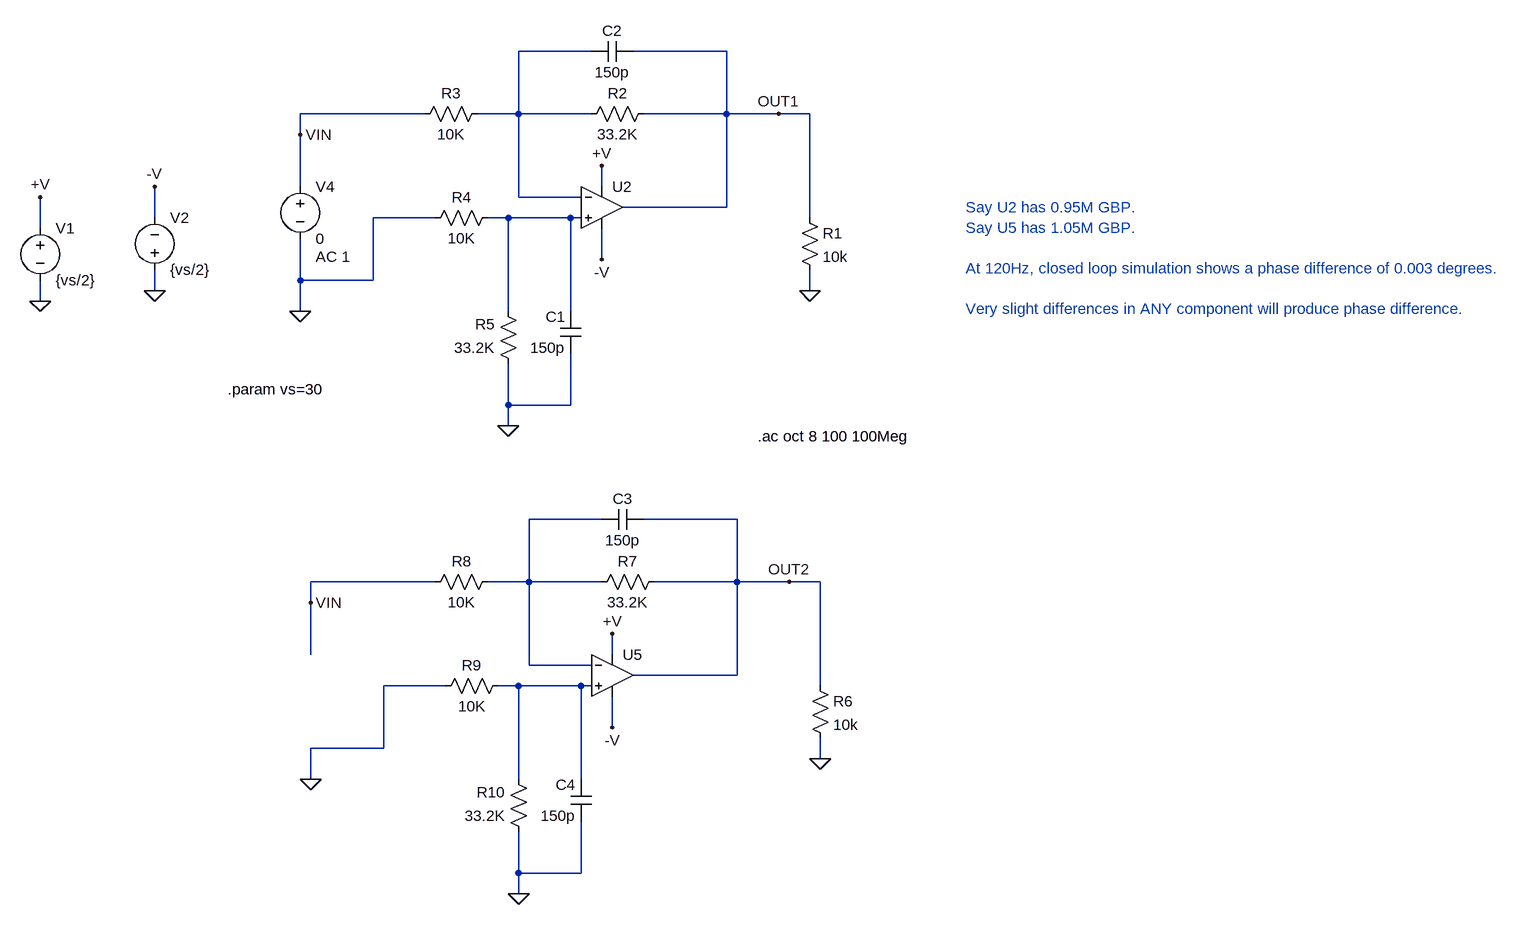
[diagram p0: schematic UnivOpAmp_AC_ClosedLoopLOC.asc]
UnivOpAmp_AC_ClosedLoopLOC.asc, the LTspice schematic file:
Version 4
SHEET 1 1700 1284
WIRE 256 -32 144 -32
WIRE 464 -32 320 -32
WIRE 0 64 -192 64
WIRE 144 64 144 -32
WIRE 144 64 80 64
WIRE 256 64 144 64
WIRE 464 64 464 -32
WIRE 464 64 336 64
WIRE 544 64 464 64
WIRE 592 64 544 64
WIRE -192 96 -192 64
WIRE -192 176 -192 96
WIRE 272 176 272 144
WIRE 144 192 144 64
WIRE 240 192 144 192
WIRE 464 208 464 64
WIRE 464 208 304 208
WIRE -416 224 -416 176
WIRE 16 224 -80 224
WIRE 128 224 96 224
WIRE 224 224 128 224
WIRE 240 224 224 224
WIRE 592 224 592 64
WIRE -592 240 -592 192
WIRE 272 288 272 240
WIRE -192 320 -192 256
WIRE -80 320 -80 224
WIRE -80 320 -192 320
WIRE -416 336 -416 304
WIRE 592 336 592 304
WIRE -592 352 -592 320
WIRE -192 368 -192 320
WIRE 128 368 128 224
WIRE 224 368 224 224
WIRE 128 512 128 448
WIRE 224 512 224 432
WIRE 224 512 128 512
WIRE 128 544 128 512
WIRE 272 688 160 688
WIRE 480 688 336 688
WIRE 16 784 -176 784
WIRE 160 784 160 688
WIRE 160 784 96 784
WIRE 272 784 160 784
WIRE 480 784 480 688
WIRE 480 784 352 784
WIRE 560 784 480 784
WIRE 608 784 560 784
WIRE -176 816 -176 784
WIRE -176 896 -176 816
WIRE 288 896 288 864
WIRE 160 912 160 784
WIRE 256 912 160 912
WIRE 480 928 480 784
WIRE 480 928 320 928
WIRE 32 944 -64 944
WIRE 144 944 112 944
WIRE 240 944 144 944
WIRE 256 944 240 944
WIRE 608 944 608 784
WIRE 288 1008 288 960
WIRE -64 1040 -64 944
WIRE -64 1040 -176 1040
WIRE 608 1056 608 1024
WIRE -176 1088 -176 1040
WIRE 144 1088 144 944
WIRE 240 1088 240 944
WIRE 144 1232 144 1168
WIRE 240 1232 240 1152
WIRE 240 1232 144 1232
WIRE 144 1264 144 1232
FLAG -592 352 0
FLAG -416 336 0
FLAG -592 192 +V
FLAG -416 176 -V
FLAG 272 144 +V
FLAG 272 288 -V
FLAG 592 336 0
FLAG 544 64 OUT1
FLAG -192 368 0
FLAG -192 96 VIN
FLAG 128 544 0
FLAG 288 864 +V
FLAG 288 1008 -V
FLAG 608 1056 0
FLAG 560 784 OUT2
FLAG -176 1088 0
FLAG -176 816 VIN
FLAG 144 1264 0
SYMBOL voltage -592 224 R0
SYMATTR InstName V1
SYMATTR Value {vs/2}
SYMBOL voltage -416 320 M180
WINDOW 0 24 96 Left 2
WINDOW 3 24 16 Left 2
WINDOW 123 0 0 Left 2
WINDOW 39 24 -12 Left 2
SYMATTR InstName V2
SYMATTR Value {vs/2}
SYMBOL res 576 208 R0
SYMATTR InstName R1
SYMATTR Value 10k
SYMBOL res 352 48 R90
WINDOW 0 0 56 VBottom 2
WINDOW 3 32 56 VTop 2
SYMATTR InstName R2
SYMATTR Value 33.2K
SYMBOL res 96 48 R90
WINDOW 0 0 56 VBottom 2
WINDOW 3 32 56 VTop 2
SYMATTR InstName R3
SYMATTR Value 10K
SYMBOL Opamps\\UniversalOpamp2 272 208 R0
SYMATTR InstName U2
SYMATTR Value2 Avol=4Meg GBW=0.95Meg Slew=0.8Meg
SYMBOL cap 320 -48 R90
WINDOW 0 0 32 VBottom 2
WINDOW 3 32 32 VTop 2
SYMATTR InstName C2
SYMATTR Value 150p
SYMBOL voltage -192 160 R0
WINDOW 123 24 124 Left 2
WINDOW 39 24 124 Left 2
SYMATTR Value2 AC 1
SYMATTR InstName V4
SYMATTR Value 0
SYMBOL res 112 208 R90
WINDOW 0 0 56 VBottom 2
WINDOW 3 32 56 VTop 2
SYMATTR InstName R4
SYMATTR Value 10K
SYMBOL res 144 464 R180
WINDOW 0 36 76 Left 2
WINDOW 3 36 40 Left 2
SYMATTR InstName R5
SYMATTR Value 33.2K
SYMBOL cap 240 432 R180
WINDOW 0 24 56 Left 2
WINDOW 3 24 8 Left 2
SYMATTR InstName C1
SYMATTR Value 150p
SYMBOL res 592 928 R0
SYMATTR InstName R6
SYMATTR Value 10k
SYMBOL res 368 768 R90
WINDOW 0 0 56 VBottom 2
WINDOW 3 32 56 VTop 2
SYMATTR InstName R7
SYMATTR Value 33.2K
SYMBOL res 112 768 R90
WINDOW 0 0 56 VBottom 2
WINDOW 3 32 56 VTop 2
SYMATTR InstName R8
SYMATTR Value 10K
SYMBOL Opamps\\UniversalOpamp2 288 928 R0
SYMATTR InstName U5
SYMATTR Value2 Avol=4Meg GBW=1.05Meg Slew=0.8Meg
SYMBOL cap 336 672 R90
WINDOW 0 0 32 VBottom 2
WINDOW 3 32 32 VTop 2
SYMATTR InstName C3
SYMATTR Value 150p
SYMBOL res 128 928 R90
WINDOW 0 0 56 VBottom 2
WINDOW 3 32 56 VTop 2
SYMATTR InstName R9
SYMATTR Value 10K
SYMBOL res 160 1184 R180
WINDOW 0 36 76 Left 2
WINDOW 3 36 40 Left 2
SYMATTR InstName R10
SYMATTR Value 33.2K
SYMBOL cap 256 1152 R180
WINDOW 0 24 56 Left 2
WINDOW 3 24 8 Left 2
SYMATTR InstName C4
SYMATTR Value 150p
TEXT -304 488 Left 2 !.param vs=30
TEXT 512 560 Left 2 !.ac oct 8 100 100Meg
TEXT 832 208 Left 2 ;Say U2 has 0.95M GBP.\nSay U5 has 1.05M GBP.\n \nAt 120Hz, closed loop simulation shows a phase difference of 0.003 degrees.\n \nVery slight differences in ANY component will produce phase difference.

The netlist it stands for:
* UnivOpAmp_AC_ClosedLoopLOC.asc
V1 +V 0 {vs/2}
V2 0 -V {vs/2}
R1 OUT1 0 10k
R2 OUT1 N001 33.2K
R3 N001 VIN 10K
XU2 N002 N001 +V -V OUT1 level.2 Avol=4Meg GBW=0.95Meg Slew=0.8Meg ilimit=25m rail=0 Vos=0 phimargin=45 en=0 enk=0 in=0 ink=0 Rin=500Meg  ; pins IN+ IN- V+ V- OUT
C2 OUT1 N001 150p
V4 VIN 0 0 AC 1
R4 N002 0 10K
R5 0 N002 33.2K
C1 0 N002 150p
R6 OUT2 0 10k
R7 OUT2 N003 33.2K
R8 N003 VIN 10K
XU5 N004 N003 +V -V OUT2 level.2 Avol=4Meg GBW=1.05Meg Slew=0.8Meg ilimit=25m rail=0 Vos=0 phimargin=45 en=0 enk=0 in=0 ink=0 Rin=500Meg  ; pins IN+ IN- V+ V- OUT
C3 OUT2 N003 150p
R9 N004 0 10K
R10 0 N004 33.2K
C4 0 N004 150p
.param vs=30
.ac oct 8 100 100Meg
* Say U2 has 0.95M GBP.
* Say U5 has 1.05M GBP.
* At 120Hz, closed loop simulation shows a phase difference of 0.003 degrees.
* Very slight differences in ANY component will produce phase difference.
.lib UniversalOpamps2.sub
.backanno
.end